# EAGLE design Communication (EAGLE 9.5.2)
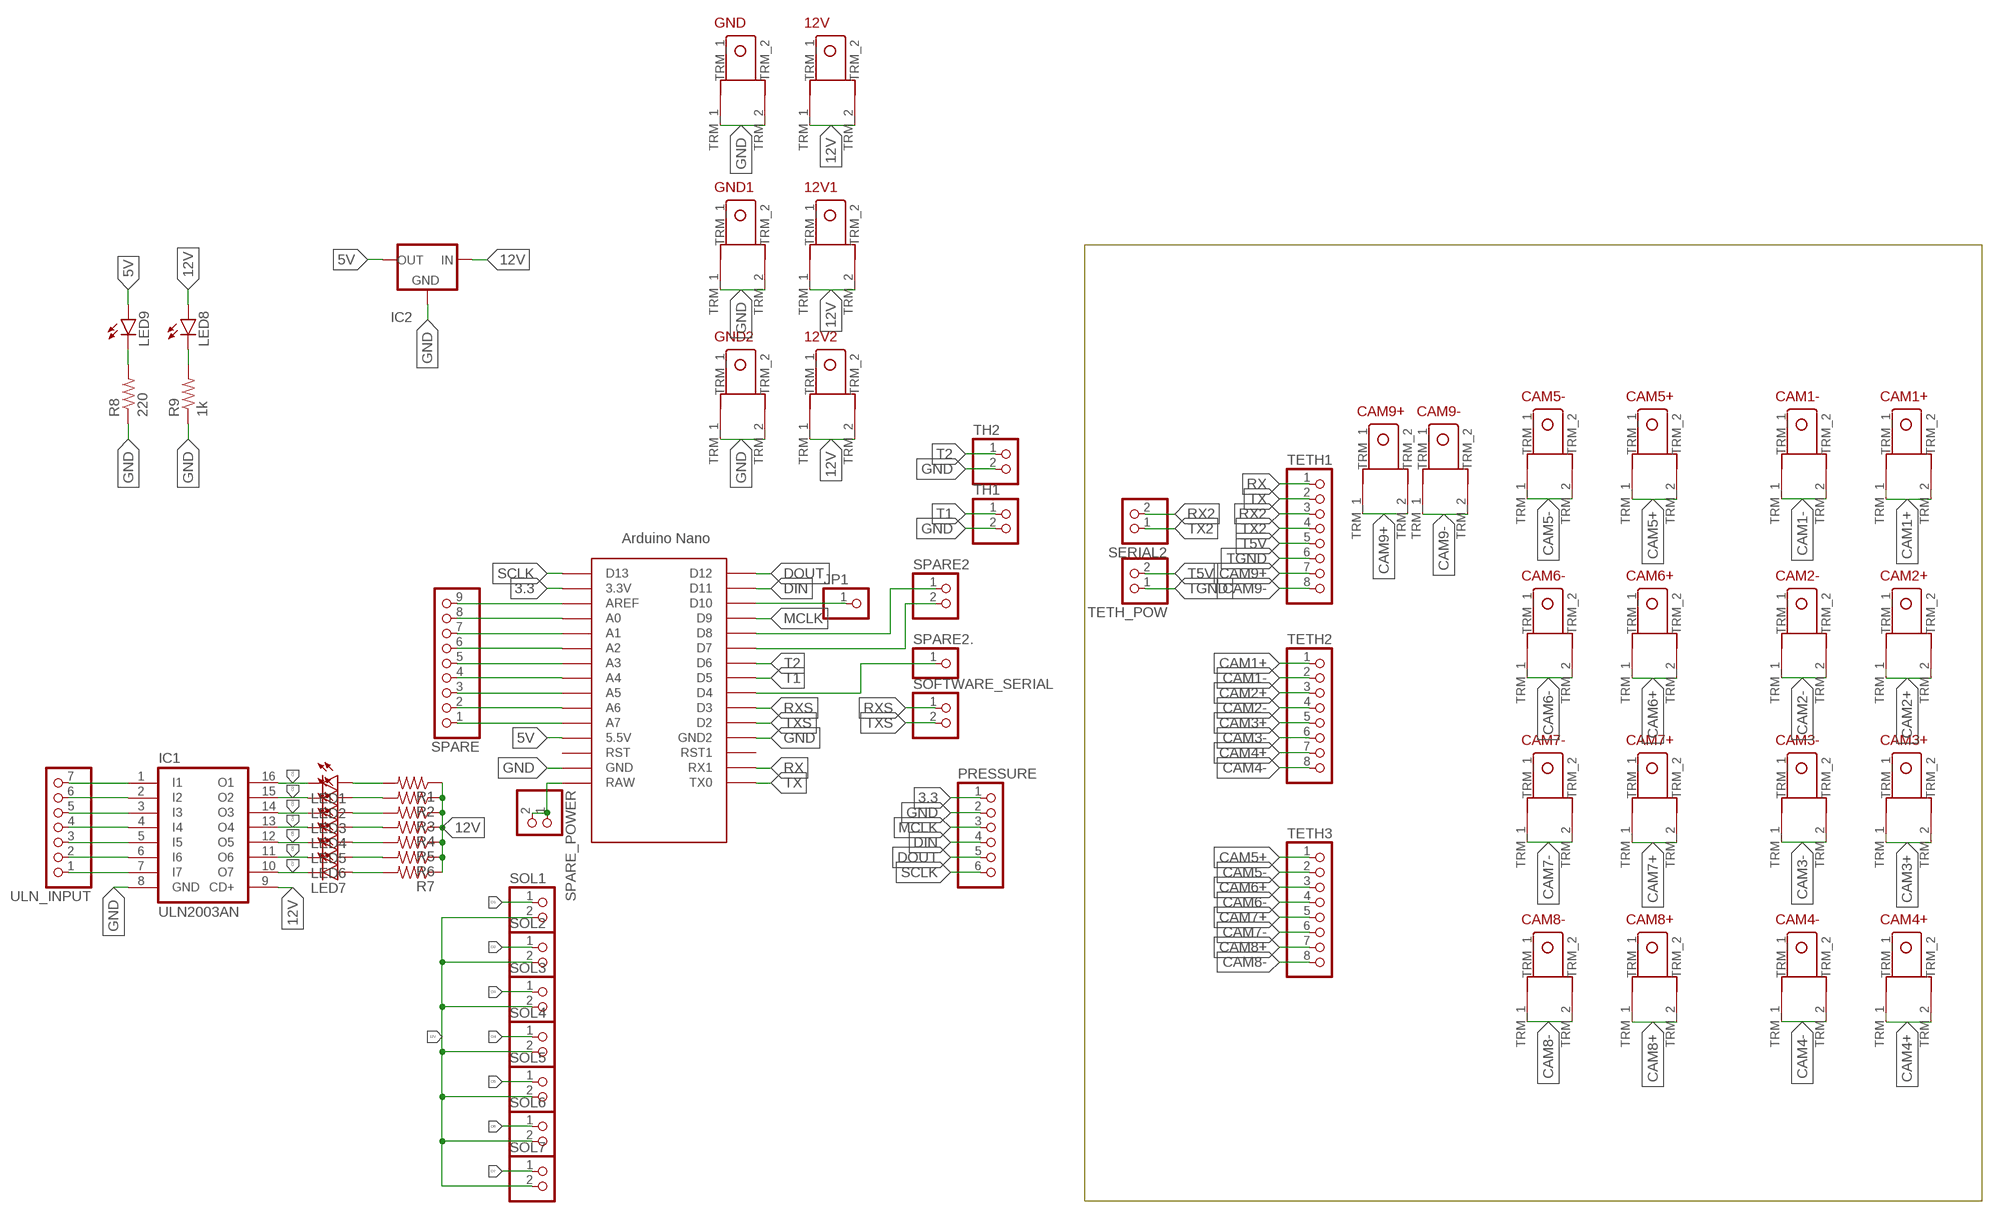
[diagram p0: schematic, sheet 1]

## Parts
12V  TERMINAL_EDITED  [TERMINAL_EDITED]
12V1  TERMINAL_EDITED  [TERMINAL_EDITED]
12V2  TERMINAL_EDITED  [TERMINAL_EDITED]
CAM1+  TERMINAL_EDITED  [TERMINAL_EDITED]
CAM1-  TERMINAL_EDITED  [TERMINAL_EDITED]
CAM2+  TERMINAL_EDITED  [TERMINAL_EDITED]
CAM2-  TERMINAL_EDITED  [TERMINAL_EDITED]
CAM3+  TERMINAL_EDITED  [TERMINAL_EDITED]
CAM3-  TERMINAL_EDITED  [TERMINAL_EDITED]
CAM4+  TERMINAL_EDITED  [TERMINAL_EDITED]
CAM4-  TERMINAL_EDITED  [TERMINAL_EDITED]
CAM5+  TERMINAL_EDITED  [TERMINAL_EDITED]
CAM5-  TERMINAL_EDITED  [TERMINAL_EDITED]
CAM6+  TERMINAL_EDITED  [TERMINAL_EDITED]
CAM6-  TERMINAL_EDITED  [TERMINAL_EDITED]
CAM7+  TERMINAL_EDITED  [TERMINAL_EDITED]
CAM7-  TERMINAL_EDITED  [TERMINAL_EDITED]
CAM8+  TERMINAL_EDITED  [TERMINAL_EDITED]
CAM8-  TERMINAL_EDITED  [TERMINAL_EDITED]
CAM9+  TERMINAL_EDITED  [TERMINAL_EDITED]
CAM9-  TERMINAL_EDITED  [TERMINAL_EDITED]
GND  TERMINAL_EDITED  [TERMINAL_EDITED]
GND1  TERMINAL_EDITED  [TERMINAL_EDITED]
GND2  TERMINAL_EDITED  [TERMINAL_EDITED]
IC1  ULN2003AN  [DIL16]
IC2  78XX-METAL  [TO3-79]
JP1  PINHD-1X1  [1X01]
LED1  LED5MM  [LED5MM]
LED2  LED5MM  [LED5MM]
LED3  LED5MM  [LED5MM]
LED4  LED5MM  [LED5MM]
LED5  LED5MM  [LED5MM]
LED6  LED5MM  [LED5MM]
LED7  LED5MM  [LED5MM]
LED8  LED5MM  [LED5MM]
LED9  LED5MM  [LED5MM]
PRESSURE  PINHD-6_DATA  [1X06_DATA]
R1  R-US_0204/7  [0204/7]
R2  R-US_0204/7  [0204/7]
R3  R-US_0204/7  [0204/7]
R4  R-US_0204/7  [0204/7]
R5  R-US_0204/7  [0204/7]
R6  R-US_0204/7  [0204/7]
R7  R-US_0204/7  [0204/7]
R8  220  R-US_0204/7  [0204/7]
R9  1k  R-US_0204/7  [0204/7]
SERIAL2  PINHD-2_DATA  [1X02_DATA]
SOFTWARE_SERIAL  PINHD-2_DATA  [1X02_DATA]
SOL1  PINHD-2_DATA  [1X02_DATA]
SOL2  PINHD-2_DATA  [1X02_DATA]
SOL3  PINHD-2_DATA  [1X02_DATA]
SOL4  PINHD-2_DATA  [1X02_DATA]
SOL5  PINHD-2_DATA  [1X02_DATA]
SOL6  PINHD-2_DATA  [1X02_DATA]
SOL7  PINHD-2_DATA  [1X02_DATA]
SPARE  PINHD-1X9  [1X09]
SPARE2  PINHD-2_DATA  [1X02_DATA]
SPARE2.  PINHD-1X1  [1X01]
SPARE_POWER  PINHD-2_DATA  [1X02_DATA]
TETH1  PINHD-8_DATA  [1X08_DATA]
TETH2  PINHD-8_DATA  [1X08_DATA]
TETH3  PINHD-8_DATA  [1X08_DATA]
TETH_POW  PINHD-2_DATA  [1X02_DATA]
TH1  PINHD-2_DATA  [1X02_DATA]
TH2  PINHD-2_DATA  [1X02_DATA]
U$1  ARDUINO_NANO  [NANO]
ULN_INPUT  PINHD-1X7  [1X07]

## Nets
3.3: PRESSURE.1 U$1.3.3V
5V: IC2.1(OUT) LED9.A U$1.5V(5.5V)
12V: 12V1.TRM_1 12V1.TRM_2 12V2.TRM_1 12V2.TRM_2 12V.TRM_1 12V.TRM_2 IC1.9(CD+) IC2.3(IN) LED8.A R1.1 R2.1 R3.1 R4.1 R5.1 R6.1 R7.1 SOL1.2 SOL2.2 SOL3.2 SOL4.2 SOL5.2 SOL6.2 SOL7.2
CAM1+: CAM1+.TRM_1 CAM1+.TRM_2 TETH2.1
CAM1-: CAM1-.TRM_1 CAM1-.TRM_2 TETH2.2
CAM2+: CAM2+.TRM_1 CAM2+.TRM_2 TETH2.3
CAM2-: CAM2-.TRM_1 CAM2-.TRM_2 TETH2.4
CAM3+: CAM3+.TRM_1 CAM3+.TRM_2 TETH2.5
CAM3-: CAM3-.TRM_1 CAM3-.TRM_2 TETH2.6
CAM4+: CAM4+.TRM_1 CAM4+.TRM_2 TETH2.7
CAM4-: CAM4-.TRM_1 CAM4-.TRM_2 TETH2.8
CAM5+: CAM5+.TRM_1 CAM5+.TRM_2 TETH3.1
CAM5-: CAM5-.TRM_1 CAM5-.TRM_2 TETH3.2
CAM6+: CAM6+.TRM_1 CAM6+.TRM_2 TETH3.3
CAM6-: CAM6-.TRM_1 CAM6-.TRM_2 TETH3.4
CAM7+: CAM7+.TRM_1 CAM7+.TRM_2 TETH3.5
CAM7-: CAM7-.TRM_1 CAM7-.TRM_2 TETH3.6
CAM8+: CAM8+.TRM_1 CAM8+.TRM_2 TETH3.7
CAM8-: CAM8-.TRM_1 CAM8-.TRM_2 TETH3.8
CAM9+: CAM9+.TRM_1 CAM9+.TRM_2 TETH1.7
CAM9-: CAM9-.TRM_1 CAM9-.TRM_2 TETH1.8
DIN: PRESSURE.4 U$1.D11
DOUT: PRESSURE.5 U$1.D12
GND: GND1.TRM_1 GND1.TRM_2 GND2.TRM_1 GND2.TRM_2 GND.TRM_1 GND.TRM_2 IC1.8(GND) IC2.2(GND) PRESSURE.2 R8.1 R9.1 TH1.2 TH2.2 U$1.GND U$1.GND1(GND2)
MCLK: PRESSURE.3 U$1.D9
N$1: SPARE_POWER.1 SPARE_POWER.2 U$1.RAW
N$2: SPARE.9 U$1.AREF
N$3: SPARE.8 U$1.A0
N$4: SPARE.7 U$1.A1
N$5: SPARE.6 U$1.A2
N$6: SPARE.5 U$1.A3
N$7: LED9.K(C) R8.2
N$8: IC1.7(I7) ULN_INPUT.1
N$9: IC1.6(I6) ULN_INPUT.2
N$10: IC1.5(I5) ULN_INPUT.3
N$11: SPARE.4 U$1.A4
N$12: SPARE.3 U$1.A5
N$13: SPARE.2 U$1.A6
N$14: SPARE.1 U$1.A7
N$19: IC1.4(I4) ULN_INPUT.4
N$20: IC1.3(I3) ULN_INPUT.5
N$21: IC1.2(I2) ULN_INPUT.6
N$22: IC1.1(I1) ULN_INPUT.7
N$23: SPARE2.1 U$1.D8
N$24: LED1.A R1.2
N$25: LED2.A R2.2
N$26: JP1.1 U$1.D10
N$27: LED8.K(C) R9.2
N$28: LED3.A R3.2
N$29: LED4.A R4.2
N$30: SPARE2.2 U$1.D7
N$31: SPARE2..1 U$1.D4
N$32: LED5.A R5.2
N$33: LED6.A R6.2
N$36: LED7.A R7.2
O1: IC1.16(O1) LED1.K(C) SOL1.1
O2: IC1.15(O2) LED2.K(C) SOL2.1
O3: IC1.14(O3) LED3.K(C) SOL3.1
O4: IC1.13(O4) LED4.K(C) SOL4.1
O5: IC1.12(O5) LED5.K(C) SOL5.1
O6: IC1.11(O6) LED6.K(C) SOL6.1
O7: IC1.10(O7) LED7.K(C) SOL7.1
RX: TETH1.1 U$1.RX1
RX2: SERIAL2.2 TETH1.3
RXS: SOFTWARE_SERIAL.1 U$1.D3
SCLK: PRESSURE.6 U$1.D13
T1: TH1.1 U$1.D5
T2: TH2.1 U$1.D6
T5V: TETH1.5 TETH_POW.2
TGND: TETH1.6 TETH_POW.1
TX: TETH1.2 U$1.TX0
TX2: SERIAL2.1 TETH1.4
TXS: SOFTWARE_SERIAL.2 U$1.D2
Unconnected: U$1.RST U$1.RST1

## Library data of the parts
12V 12V1 12V2 CAM1+ CAM1- CAM2+ CAM2- CAM3+ CAM3- CAM4+ CAM4- CAM5+ CAM5- CAM6+ CAM6- CAM7+ CAM7- CAM8+ CAM8- CAM9+ CAM9- GND GND1 GND2 = MIA_LIBRARY-2-2-2:TERMINAL_EDITED
IC1 = MIA_LIBRARY-2-2-2:ULN2003A: DRIVER ARRAY
IC2 = MIA_LIBRARY-2-2-2:78XX-METAL: VOLTAGE REGULATOR
JP1 = pinhead:PINHD-1X1: PIN HEADER
LED1-LED9 = led:LED: LED OSRAM: - CHIPLED LG R971, LG N971, LY N971, LG Q971, LY Q971, LO R971, LY R971 LH N974, LH R974 LS Q976, LO Q976, LY Q976 LO Q996 - Hyper CHIPLED LW Q18S LB Q993, LB Q99A, LB R99A - SideLED LS A670, LO A670, LY A670, LG A670, LP A670 LB A673, LV A673, LT A673, LW A673 LH A674 LY A675 LS A676, LA A676, LO A676, LY A676, LW A676 LS A679, LY A679, LG A679 - Hyper Micro SIDELED® LS Y876, LA Y876, LO Y876, LY Y876 LT Y87S - SmartLED LW L88C, LW L88S LB L89C, LB L89S, LG L890 LS L89K, LO L89K, LY L89K LS L896, LA L896, LO L896, LY L896 - TOPLED LS T670, LO T670, LY T670, LG T670, LP T670 LSG T670, LSP T670, LSY T670, LOP T670, LYG T670 LG T671, LOG T671, LSG T671 LB T673, LV T673, LT T673, LW T673 LH T674 LS T676, LA T676, LO T676, LY T676, LB T676, LH T676, LSB T676, LW T676 LB T67C, LV T67C, LT T67C, LS T67K, LO T67K, LY T67K, LW E67C LS E67B, LA E67B, LO E67B, LY E67B, LB E67C, LV E67C, LT E67C LW T67C LS T679, LY T679, LG T679 LS T770, LO T770, LY T770, LG T770, LP T770 LB T773, LV T773, LT T773, LW T773 LH T774 LS E675, LA E675, LY E675, LS T675 LS T776, LA T776, LO T776, LY T776, LB T776 LHGB T686 LT T68C, LB T68C - Hyper Mini TOPLED® LB M676 - Mini TOPLED Santana® LG M470 LS M47K, LO M47K, LY M47K Source: http://www.osram.convergy.de LUXEON: - LUMILED® LXK2-PW12-R00, LXK2-PW12-S00, LXK2-PW14-U00, LXK2-PW14-V00 LXK2-PM12-R00, LXK2-PM12-S00, LXK2-PM14-U00 LXK2-PE12-Q00, LXK2-PE12-R00, LXK2-PE12-S00, LXK2-PE14-T00, LXK2-PE14-U00 LXK2-PB12-K00, LXK2-PB12-L00, LXK2-PB12-M00, LXK2-PB14-N00, LXK2-PB14-P00, LXK2-PB14-Q00 LXK2-PR12-L00, LXK2-PR12-M00, LXK2-PR14-Q00, LXK2-PR14-R00 LXK2-PD12-Q00, LXK2-PD12-R00, LXK2-PD12-S00 LXK2-PH12-R00, LXK2-PH12-S00 LXK2-PL12-P00, LXK2-PL12-Q00, LXK2-PL12-R00 Source: www.luxeon.com KINGBRIGHT: KA-3528ASYC Source: www.kingbright.com
PRESSURE = MIA_LIBRARY-2-2-2:PINHD-6_DATA: PIN HEADER
R1-R9 = rcl:R-US_: RESISTOR, American symbol; SPICEPREFIX: R
SERIAL2 SOFTWARE_SERIAL SOL1-SOL7 SPARE2 SPARE_POWER TETH_POW TH1 TH2 = MIA_LIBRARY-2-2-2:PINHD-2_DATA: PIN HEADER
SPARE = pinhead:PINHD-1X9: PIN HEADER
SPARE2. = pinhead_mo:PINHD-1X1: PIN HEADER
TETH1-TETH3 = MIA_LIBRARY-2-2-2:PINHD-8_DATA: PIN HEADER
U$1 = MIA_LIBRARY-2-2-2:ARDUINO_NANO: Arduino Nano
ULN_INPUT = Pinhead_Modified:PINHD-1X7: PIN HEADER

## Board
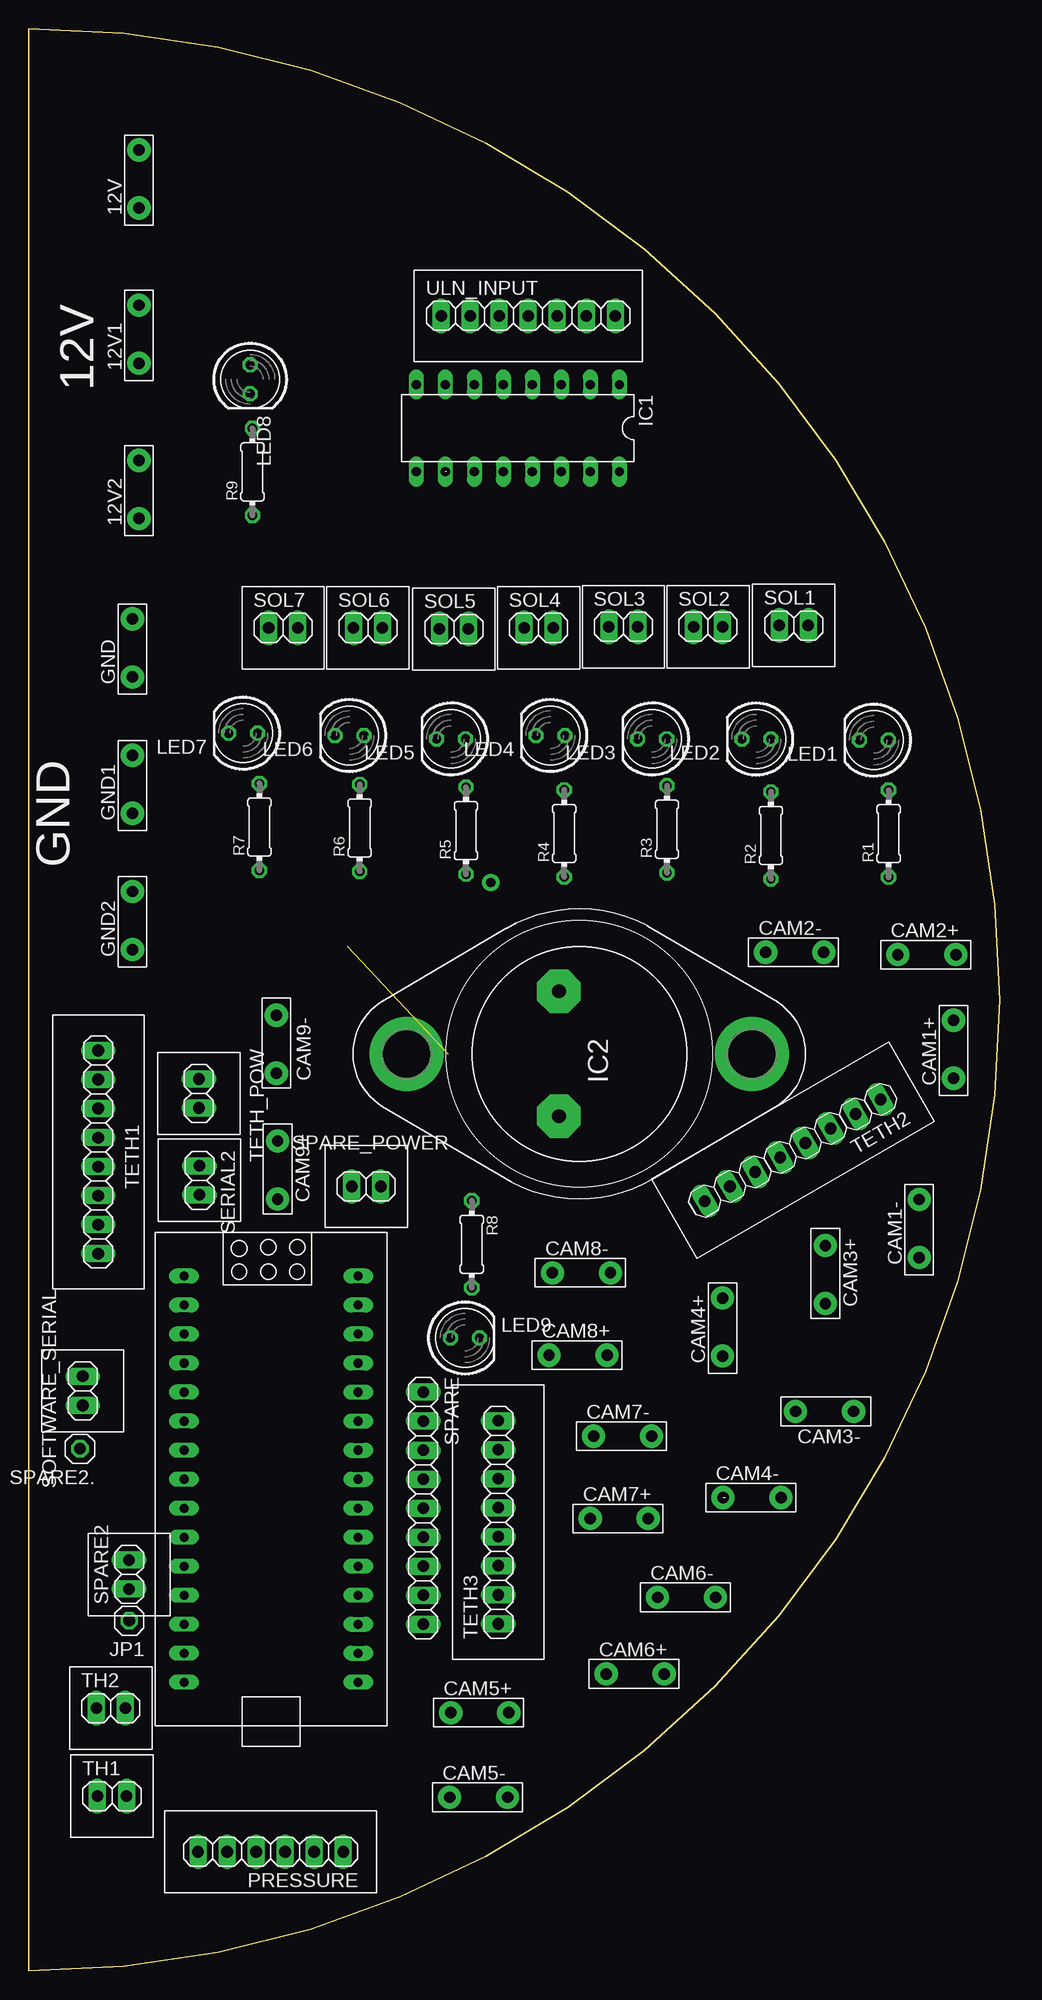
[diagram p1: board, top side]
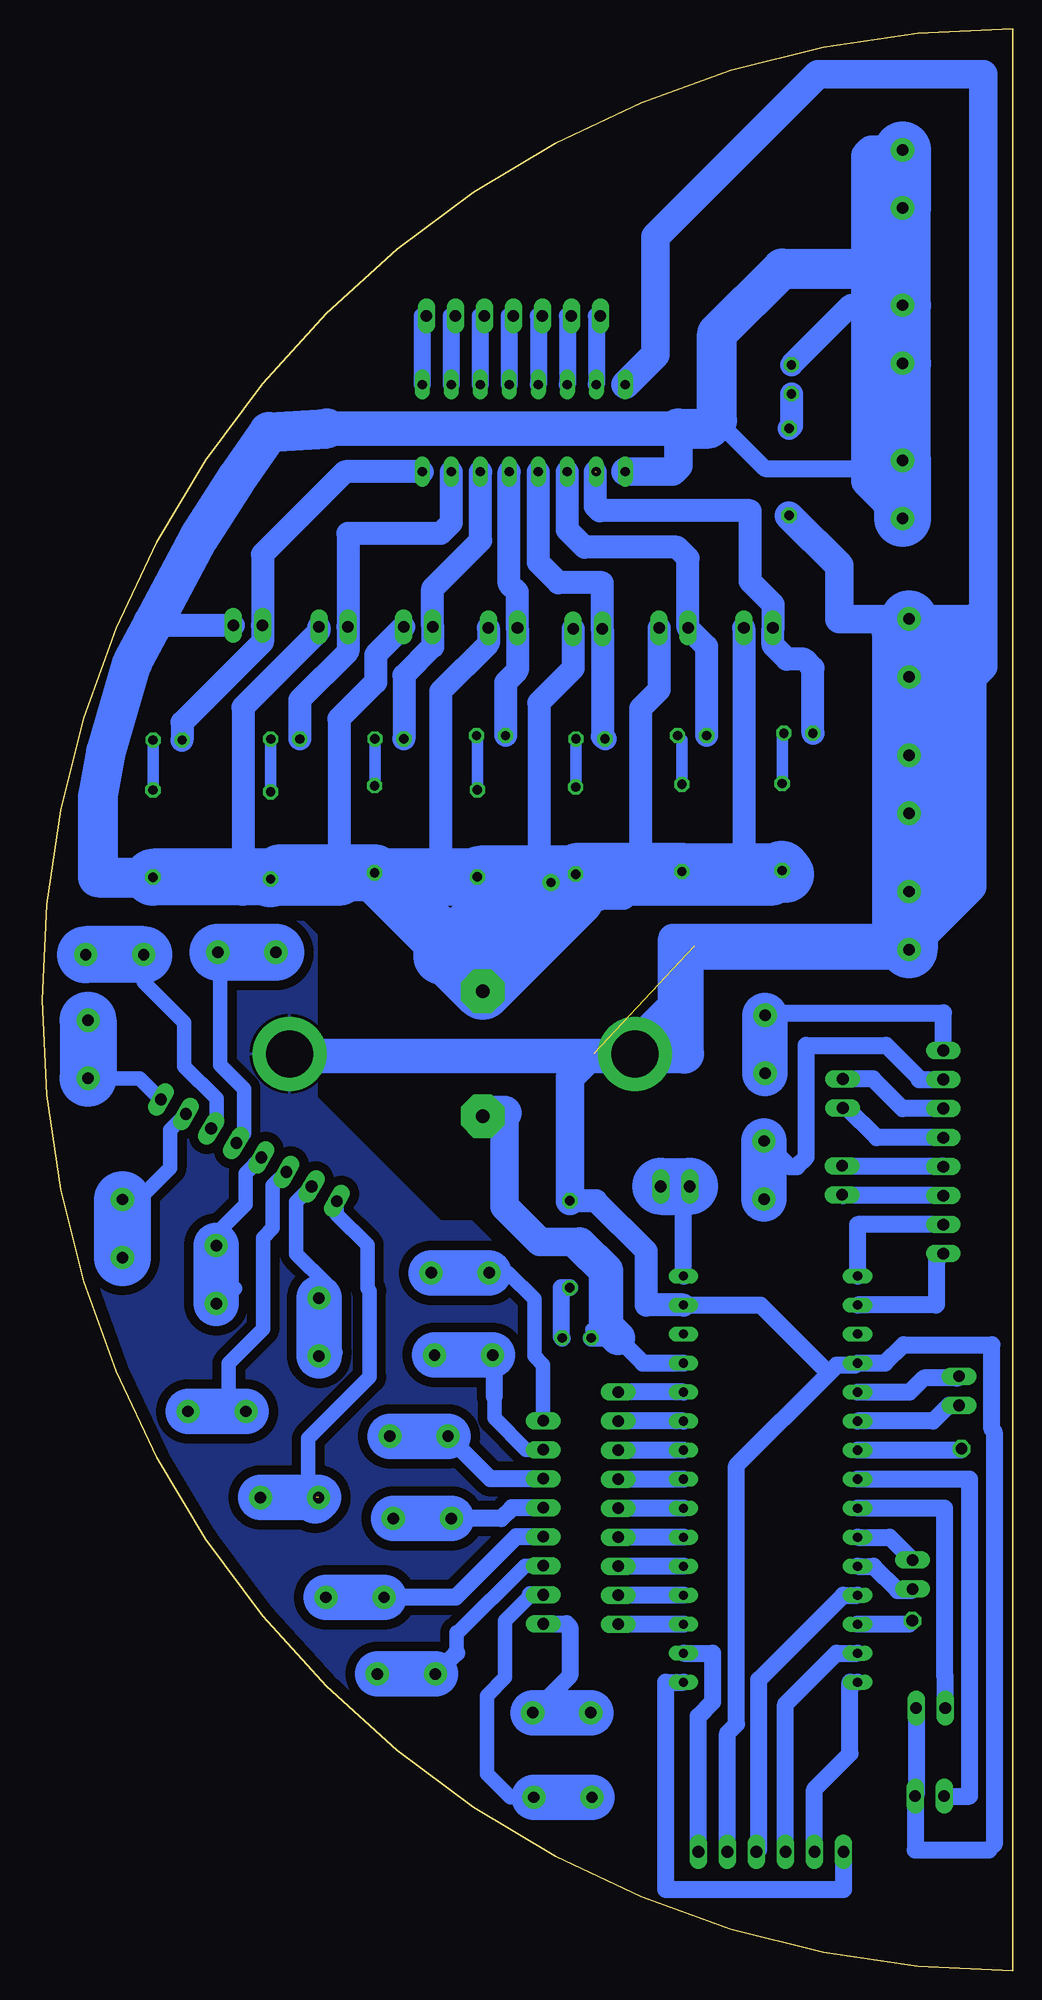
[diagram p2: board, bottom side, seen from below]

Size 85 x 170 mm. Coordinates in mm from the lower left corner, seen from the top.
Outline: 0,0 0,170 arc-180 0,0
Copper layers (1*16): Top 0.035mm / dielectric 1.5mm / Bottom 0.035mm
Design rules "default *": minimum track width 1mm, minimum drill 0.35mm, track to track 0.4mm, track to pad 0.4mm, pad to pad 6mil, via to via 6mil, smd to smd 6mil, copper to edge 40mil, drill to drill 6mil, minimum pad ring 10mil, minimum via ring 8mil, stop-mask expansion 4mil, vias tented up to drill 0mil, thermal gap 10mil

### Footprints (pad centres in the part's own frame; a part is rotated, then mirrored left to right if it is on the bottom)
TERMINAL_EDITED = drill 1 pad 2.032: TRM_1 -2.54,0; TRM_2 2.54,0
DIL16 = drill 0.813 long: 1 -8.89,-3.81; 2 -6.35,-3.81; 3 -3.81,-3.81; 4 -1.27,-3.81; 5 1.27,-3.81; 6 3.81,-3.81; 7 6.35,-3.81; 8 8.89,-3.81; 9 8.89,3.81; 10 6.35,3.81; 11 3.81,3.81; 12 1.27,3.81; 13 -1.27,3.81; 14 -3.81,3.81; 15 -6.35,3.81; 16 -8.89,3.81
TO3-79 = drill 1.194 pad 3.81 octagon: 1 -1.778,-5.461; 3 -1.778,5.461 | drill 4.115 pad 6.477: 2 15.113,0; 3@ -15.113,0
1X01 = drill 1.016 octagon: 1 0,0
LED5MM = drill 0.813 octagon: A -1.27,0; K 1.27,0
1X06_DATA = drill 1.016 long: 1 -6.35,0; 2 -3.81,0; 3 -1.27,0; 4 1.27,0; 5 3.81,0; 6 6.35,0
0204/7 = drill 0.813 octagon: 1 -3.81,0; 2 3.81,0
1X02_DATA = drill 1.016 long: 1 -1.27,0; 2 1.27,0
1X09 = drill 1.016 long: 1 -10.16,0; 2 -7.62,0; 3 -5.08,0; 4 -2.54,0; 5 0,0; 6 2.54,0; 7 5.08,0; 8 7.62,0; 9 10.16,0
1X08_DATA = drill 1.016 long: 1 -8.89,0; 2 -6.35,0; 3 -3.81,0; 4 -1.27,0; 5 1.27,0; 6 3.81,0; 7 6.35,0; 8 8.89,0
NANO = drill 0.8 long: 3.3V -10.16,24.13; 5V -10.16,-1.27; A0 -10.16,19.05; A1 -10.16,16.51; A2 -10.16,13.97; A3 -10.16,11.43; A4 -10.16,8.89; A5 -10.16,6.35; A6 -10.16,3.81; A7 -10.16,1.27; AREF -10.16,21.59; D2 5.08,1.27; D3 5.08,3.81; D4 5.08,6.35; D5 5.08,8.89; D6 5.08,11.43; D7 5.08,13.97; D8 5.08,16.51; D9 5.08,19.05; D10 5.08,21.59; D11 5.08,24.13; D12 5.08,26.67; D13 -10.16,26.67; GND -10.16,-6.35; GND1 5.08,-1.27; RAW -10.16,-8.89; RST -10.16,-3.81; RST1 5.08,-3.81; RX1 5.08,-6.35; TX0 5.08,-8.89
1X07 = drill 1.016 long: 1 -7.62,0; 2 -5.08,0; 3 -2.54,0; 4 0,0; 5 2.54,0; 6 5.08,0; 7 7.62,0

### Placement (x,y rotation side)
12V  9.67,156.84 90 top
12V1  9.67,143.25 90 top
12V2  9.67,129.66 90 top
CAM1+  80.97,80.67 90 top
CAM1-  77.97,64.98 90 top
CAM2+  78.64,88.95 0 top
CAM2-  67.07,89.15 0 top
CAM3+  69.75,60.95 270 top
CAM3-  69.68,48.97 180 top
CAM4+  60.75,56.36 90 top
CAM4-  63.33,41.43 0 top
CAM5+  39.5,22.6 0 top
CAM5-  39.4,15.2 0 top
CAM6+  53.1,26 0 top
CAM6-  57.6,32.7 0 top
CAM7+  51.7,39.6 0 top
CAM7-  52,46.8 0 top
CAM8+  48.1,53.9 0 top
CAM8-  48.4,61.1 0 top
CAM9+  21.8,70.1 270 top
CAM9-  21.7,81.1 270 top
GND  9.09,115.79 90 top
GND1  9.09,103.86 90 top
GND2  9.09,91.93 90 top
IC1  42.83,135.03 180 top
IC2  48.21,80.27 0 top
JP1  8.81,30.65 180 top
LED1  74.01,107.72 180 top
LED2  63.71,107.82 180 top
LED3  54.59,107.83 180 top
LED4  45.69,108.13 180 top
LED5  36.99,107.83 180 top
LED6  28.09,108.13 180 top
LED7  18.79,108.33 180 top
LED8  19.4,139.3 270 top
LED9  38.2,55.4 0 top
PRESSURE  21.19,10.43 180 top
R1  75.29,99.54 90 top
R2  64.99,99.38 90 top
R3  55.89,99.92 90 top
R4  46.89,99.56 90 top
R5  38.29,99.8 90 top
R6  28.99,100.04 90 top
R7  20.21,100.12 90 top
R8  38.8,63.6 270 top
R9  19.6,131.2 90 top
SERIAL2  14.96,69.2 270 top
SOFTWARE_SERIAL  4.74,50.77 90 top
SOL1  66.98,117.76 0 top
SOL2  59.49,117.65 0 top
SOL3  52.07,117.65 0 top
SOL4  44.65,117.55 0 top
SOL5  37.23,117.45 0 top
SOL6  29.71,117.55 0 top
SOL7  22.29,117.55 0 top
SPARE  34.55,40.5 270 top
SPARE2  8.8,34.7 90 top
SPARE2.  4.5,45.7 180 top
SPARE_POWER  29.56,68.66 0 top
TETH1  6.1,71.67 90 top
TETH2  66.9,71.83 210 top
TETH3  41.13,39.27 90 top
TETH_POW  14.9,76.8 270 top
TH1  7.3,15.3 0 top
TH2  7.2,23 0 top
U$1  18.69,51.93 180 top
ULN_INPUT  43.74,144.86 0 top

### Tracks (layer width: path | path; a pad name or v marks a point on that pad's centre or on a via)
3.3
  Bottom 1.5: U$1.3.3V 26.3,27.8 26.3,23.53 27.54,22.29 PRESSURE.1
5V
  Bottom 1: 36.93,56.17 LED9.A
  Bottom 1.5: LED9.A 34.6,55.4 32.4,53.2 U$1.5V
  Bottom 2.5: 37.96,63.6 38.16,63.8 41.4,63.8 44.5,66.9 44.5,75.1
  Bottom 3: 34.6,55.4 35.65,56.45 35.65,61.29 37.96,63.6 | 44.5,75.1 46.14,75.1 IC2.1
12V  (via drill 0.8 pad 1.5)
  Bottom 1: 41.9,93.2 37.3,93.2
  Bottom 1.5: 25.9,135.7 21.7,131.5 10.37,131.5 12V2.TRM_2
  Bottom 2: SOL7.2 23.56,96.17 24,95.73 | SOL6.2 30.98,112.12 32.6,110.5 32.6,95.73 | SOL5.2 38.5,114 41.5,111 41.5,97.2 | 41.5,97.2 41.5,95.73 | SOL4.2 45.92,116.18 50.1,112 50.1,95.73 | SOL3.2 55.8,115.19 55.8,112.8 59,109.6 59,96.9 | 59,96.9 59,95.73 | SOL2.2 60.76,117.25 67.4,110.61 67.4,95.73 | SOL1.2 75.09,117.76 75.27,117.94 | 41.5,97.2 58.7,97.2 59,96.9 | 36.6,94.3 R5.1 29.23,95.99 R6.1 34.67,96.23 36.6,94.3 | 36.6,94.3 36.2,94.3 36.2,93.8 39.1,93.8 | 44.2,94.9 43.84,95.26 v40.46,95.26 39.99,95.73 43.06,95.73 46.5,92.29 | 37.8,95.73 35.97,93.9 34.1,93.9 | LED8.A 14.18,145.79 12V1.TRM_2
  Bottom 2.5: IC1.9 29.83,131.22 29.3,131.75 29.3,135
  Bottom 2.54: 12V2.TRM_1 12.9,130.35 12.9,158.9 12.42,159.38 12V.TRM_2
  Bottom 3: R1.1 75.36,95.8 | 60.05,135 29.3,135 | 46.5,92.29 42.81,92.29 41.9,93.2
  Bottom 3.5: R1.1 75.32,95.7 80.1,95.7 80.1,102.81 79.4,106.7 77.1,114.5 75.27,117.94 71.3,125.4 67.94,130.67 65.13,134.68 60.05,135 | 29.3,135 26.6,135 25.9,135.7 25.9,143.3 20.2,149 10.2,149 9.67,148.47 12V1.TRM_2
  Bottom 5: 65.15,95.73 64.5,95.73 | 64.5,95.73 59,95.73 | 55.5,95.73 50.1,95.73 46.9,95.73 | 46.9,95.73 41.5,95.73 39.99,95.73 37.8,95.73 32.6,95.73 24,95.73 21.24,95.73 20.44,96.29 | 20.44,96.29 20.27,96.4 20.21,96.34 R7.1 19.9,96 | 20.44,96.29 20.53,96.23 R6.1 38.05,96.23 R5.1 | R5.1 46.65,95.99 R4.1 55.48,95.75 55.5,95.73 | R3.1 64.12,96.11 64.5,95.73 | R2.1 65.15,95.73 | 65.15,95.73 67.4,95.73 R1.1 | 46.9,95.73 46.5,95.33 46.5,92.29 49.99,88.8 49.99,89.29 | 55.5,95.73 49.99,90.22 49.99,89.29 | 49.99,89.29 IC2.3 38.29,93.87 R5.1 | 12V.TRM_2 12V.TRM_1 12V1.TRM_2 12V1.TRM_1 12V2.TRM_2 12V2.TRM_1
CAM1+
  Bottom 1.25: TETH2.1 76.45,78.13 CAM1+.TRM_1
  Bottom 5: CAM1+.TRM_2 CAM1+.TRM_1
CAM1-
  Bottom 1.25: TETH2.2 73.79,73.62 73.79,70.27 76.53,67.52 CAM1-.TRM_2
  Bottom 5: CAM1-.TRM_2 CAM1-.TRM_1
CAM2+
  Bottom 1.25: CAM2+.TRM_1 76.1,86.55 72.56,83.01 72.56,79.18 69.73,76.35 69.73,74.2 TETH2.3
  Bottom 5: CAM2+.TRM_1 CAM2+.TRM_2
CAM2-
  Bottom 1.25: TETH2.4 67.94,72.52 67.94,72.68 67.31,73.32 67.31,77.2 69.41,79.3 69.41,88.95 CAM2-.TRM_2
  Bottom 5: CAM2-.TRM_1 CAM2-.TRM_2
CAM3+
  Bottom 1.25: CAM3+.TRM_2 68.09,59.73 69.22,59.73 69.72,60.23 69.72,64.55 67.18,67.09 67.18,69.81 TETH2.5
  Bottom 4: CAM3+.TRM_1 CAM3+.TRM_2
CAM3-
  Bottom 1.25: CAM3-.TRM_2 68.66,48.97 68.66,53.17 65.66,56.17 65.66,64.17 64.8,65.03 64.8,68.72 TETH2.6
  Bottom 4: CAM3-.TRM_1 CAM3-.TRM_2
CAM4+
  Bottom 1.25: TETH2.7 62.74,67.32 62.74,62.77 60.07,60.11 60.07,54.9 59.32,54.15 CAM4+.TRM_1
  Bottom 4: CAM4+.TRM_1 CAM4+.TRM_2
CAM4-  (1 unrouted)
  Bottom 1.25: CAM4-.TRM_1 61.7,42.34 61.7,46.6 56.32,51.98 56.32,59.53 56.52,59.73 56.52,63.54 59.2,66.22 TETH2.8
  Bottom 4: CAM4-.TRM_2 60.99,41.43 | CAM4-.TRM_1 61.09,41.13
CAM5+
  Bottom 1.5: TETH3.1 39.08,30.38 38.8,30.1 38.8,25.84 CAM5+.TRM_2
  Bottom 4: CAM5+.TRM_2 CAM5+.TRM_1
CAM5-
  Bottom 1.25: TETH3.2 42.17,32.92 44.45,30.64 44.45,25.69 46.05,24.09 46.05,17.26 43.99,15.2 CAM5-.TRM_2
  Bottom 1.5: TETH3.2 42.28,32.92 | 42.46,15.2 CAM5-.TRM_2
  Bottom 4: CAM5-.TRM_1 CAM5-.TRM_2
CAM6+
  Bottom 1.25: TETH3.3 42.74,35.46 48.57,29.63 48.7,29.63 48.7,27.8
  Bottom 1.5: CAM6+.TRM_1 48.76,27.8 48.7,27.8
  Bottom 4: CAM6+.TRM_1 CAM6+.TRM_2
CAM6-
  Bottom 1.5: TETH3.4 43.5,38 48.8,32.7 CAM6-.TRM_1
  Bottom 4: CAM6-.TRM_1 CAM6-.TRM_2
CAM7+
  Bottom 1.5: TETH3.5 43.86,40.54 44.8,39.6 CAM7+.TRM_1
  Bottom 4: CAM7+.TRM_1 CAM7+.TRM_2
CAM7-
  Bottom 1.5: TETH3.6 45.74,43.08 CAM7-.TRM_1
  Bottom 4: CAM7-.TRM_1 CAM7-.TRM_2
CAM8+
  Bottom 1.25: TETH3.7 42.62,45.62 45.4,48.4 45.4,50.3
  Bottom 1.5: 45.4,50.3 45.4,53.9 CAM8+.TRM_1
  Bottom 4: CAM8+.TRM_1 CAM8+.TRM_2
CAM8-
  Bottom 1.25: TETH3.8 41.13,53.03 41.91,53.81 41.91,58.81 44.2,61.1 CAM8-.TRM_1
  Bottom 4: CAM8-.TRM_1 CAM8-.TRM_2
CAM9+
  Bottom 1.5: TETH1.7 8.22,78.02 8.22,78.12 11.1,81 18.1,81 18.1,71.2 18.9,70.4 19.56,70.4 CAM9+.TRM_1
  Bottom 4: CAM9+.TRM_1 CAM9+.TRM_2
CAM9-
  Bottom 1.5: TETH1.8 6.1,83.86 21.48,83.86 CAM9-.TRM_1
  Bottom 4: CAM9-.TRM_1 CAM9-.TRM_2
DIN
  Bottom 1.5: U$1.D11 15.46,27.8 19.92,23.34 PRESSURE.4
DOUT
  Bottom 1.5: U$1.D12 14.26,25.26 14.26,19.01 17.38,15.89 PRESSURE.5
GND  (1 unrouted)
  Bottom 1: 2.1,10.6 1.64,11.06 | 1.64,47.2 1.84,47.4
  Bottom 1.5: PRESSURE.2 25,20.8 24.2,21.6 24.2,44.23 16.12,52.3 | 16.12,52.3 15.43,53 13.81,53 U$1.GND1 11.2,53.2 9.6,54.8 1.84,54.8 1.84,47.4 | U$1.GND 22.11,58.28 16.12,52.3 | TH2.2 8.47,15.4 TH1.2 8.57,10.6 2.1,10.6 | 1.64,47.2 1.64,11.06
  Bottom 2: U$1.GND 32.1,58.28 32.1,63.02 36.49,67.41 R8.1
  Bottom 2.5: R9.1 15.2,122.99 15.2,118.33 GND.TRM_2 | IC1.8 31.3,141.48 31.3,151.8 17.1,166 2.6,166 2.6,114.18 3.53,113.25 GND.TRM_1 | 36.73,80.27 38.8,78.2 R8.1
  Bottom 2.54: GND.TRM_2 3.73,118.33 3.6,118.2 3.6,94.88 5.64,92.84 | 5.64,92.84 GND2.TRM_1 | 5.64,92.84 5.64,116.86 5.4,117.1 6.25,117.95 10.25,117.95 11.1,117.1 11.1,90.4 12.11,89.39 28.21,89.39 | 34.2,80.1 29.8,84.5 29.8,90.4 10.1,90.4 9,91.5 9,118.9
  Bottom 3: 28.8,80.27 28.97,80.1 34.2,80.1 63.15,80.1 IC2.2
  Bottom 3.5: 28.8,80.27 28.8,88.8 28.21,89.39 | 28.21,89.39 27.89,89.71 | 28.21,89.39 GND2.TRM_1
  Bottom 5: GND2.TRM_2 GND2.TRM_1 GND1.TRM_1 | GND1.TRM_1 GND1.TRM_2 | GND.TRM_2 GND.TRM_1 GND1.TRM_1
  pour Bottom (isolate 0.813): 47.4,65.7 40.7,59 40.7,54.3 39.2,52.8 38.7,52.8 37.8,51.9 37.8,33.5 37.1,32.8 37.1,26.5 34.5,26.5 34.4,26.6 34.4,11.9 35,11.3 40.3,11.3 41.3,12.3 47.8,12.3 66.67,31.17 69.67,31.17 87.4,48.9 87.4,91.9 62.1,91.9 60.9,90.7 60.9,76.5 50.1,65.7
MCLK
  Bottom 1.5: U$1.D9 14.86,32.88 22.26,25.48 22.26,10.63 PRESSURE.3
N$1
  Bottom 1.5: U$1.RAW 28.85,66.68 SPARE_POWER.2
  Bottom 5: SPARE_POWER.2 SPARE_POWER.1
N$2
  Bottom 1.5: U$1.AREF SPARE.9
N$3
  Bottom 1.5: U$1.A0 SPARE.8
N$4
  Bottom 1.5: U$1.A1 SPARE.7
N$5
  Bottom 1.5: U$1.A2 SPARE.6
N$6
  Bottom 1.5: U$1.A3 SPARE.5
N$7
  Bottom 1.5: R8.2 39.57,59.79 39.57,55.5 LED9.K
N$8
  Bottom 1.5: ULN_INPUT.1 36.48,144.86 IC1.7
N$9
  Bottom 1.5: ULN_INPUT.2 39.02,144.86 IC1.6
N$10
  Bottom 1.5: ULN_INPUT.3 41.56,144.86 IC1.5
N$11
  Bottom 1.5: U$1.A4 SPARE.4
N$12
  Bottom 1.5: U$1.A5 SPARE.3
N$13
  Bottom 1.5: U$1.A6 SPARE.2
N$14
  Bottom 1.5: U$1.A7 SPARE.1
N$19
  Bottom 1.5: ULN_INPUT.4 44.1,144.86 IC1.4
N$20
  Bottom 1.5: ULN_INPUT.5 46.64,144.86 IC1.3
N$21
  Bottom 1.5: ULN_INPUT.6 49.18,144.86 IC1.2
N$22
  Bottom 1.5: ULN_INPUT.7 51.72,144.86 IC1.1
N$23
  Bottom 1.5: U$1.D8 12.22,35.42 10.1,33.3 8.93,33.3 SPARE2.1
N$24
  Bottom 1: LED1.A R1.2
N$25
  Bottom 1: LED2.A R2.2
N$26
  Bottom 1.5: JP1.1 9.12,30.34 U$1.D10
N$27
  Bottom 2: LED8.K 19.4,135.21 R9.2
N$28
  Bottom 1: LED3.A 55.86,103.76 R3.2
N$29
  Bottom 1: R4.2 46.89,108.06 LED4.A
N$30
  Bottom 1.5: U$1.D7 10.79,37.96 SPARE2.2
N$31
  Bottom 1.5: SPARE2..1 4.62,45.58 U$1.D4
N$32
  Bottom 1: LED5.A 38.26,103.64 R5.2
N$33
  Bottom 1: R6.2 28.99,107.76 LED6.A
N$36
  Bottom 1: LED7.A 20.21,108.18 R7.2
O1
  Bottom 2: LED1.K 72.74,109.26 65.71,116.29 SOL1.1 65.71,123.99 58.48,131.22 IC1.16
O2
  Bottom 2: LED2.K 62.44,111.26 58.22,115.48 SOL2.1 58.22,125.8 50.1,125.8 49.18,126.72 IC1.15
O3
  Bottom 2: LED3.K 53.32,113.38 50.8,115.9 SOL3.1 50.8,121 46.6,125.2 46.6,131.18 IC1.14
O4
  Bottom 2: LED4.K 44.42,112.78 43.38,113.82 SOL4.1 43.38,120.68 44.1,121.4 IC1.13
O5
  Bottom 2: LED5.K 35.96,108.07 SOL5.1 35.96,121.5 39.8,121.5 41.56,123.26 IC1.12
O6
  Bottom 2: LED6.K 26.82,115.93 SOL6.1 28.44,123.64 29.4,124.6 37.5,124.6 39.02,126.12 IC1.11
O7  (1 unrouted)
  Bottom 2: LED7.K 17.52,114.05 18.27,114.8 19.8,114.8 21.02,116.02 SOL7.1 21.02,119.62 23,121.6 23,127.8 36.2,127.8 36.59,128.19 36.59,131.22
RX
  Bottom 1.5: TETH1.1 6.7,62.18 6.7,58.3 6.72,58.28 U$1.RX1
RX2
  Bottom 1.5: TETH1.3 14.89,67.86 SERIAL2.2
RXS
  Bottom 1.5: SOFTWARE_SERIAL.1 5.6,49.5 6.98,48.12 U$1.D3
SCLK
  Bottom 1.5: U$1.D13 30.4,25.26 30.4,7.14 14.84,7.14 PRESSURE.6
T1
  Bottom 1.5: TH1.1 3.8,15.3 3.8,43.04 U$1.D5
T2
  Bottom 1.5: TH2.1 5.93,25.8 6,25.87 6,40.5 U$1.D6
T5V
  Bottom 1.5: TETH1.5 11.94,72.94 14.53,75.53 TETH_POW.2
TGND
  Bottom 1.5: TETH1.6 9.68,75.48 12.27,78.07 TETH_POW.1
TX
  Bottom 1.5: TETH1.2 13.61,65.32 U$1.TX0
TX2
  Bottom 1.5: SERIAL2.1 6.17,70.47 TETH1.4
TXS
  Bottom 1.5: U$1.D2 9.04,50.66 7.8,51.9 4.88,51.9 SOFTWARE_SERIAL.2

### Text on the board
tNames: 12V | GND